# Altium schematic sheet MainSch.SchDoc: TestBoard (part 2 of 3)
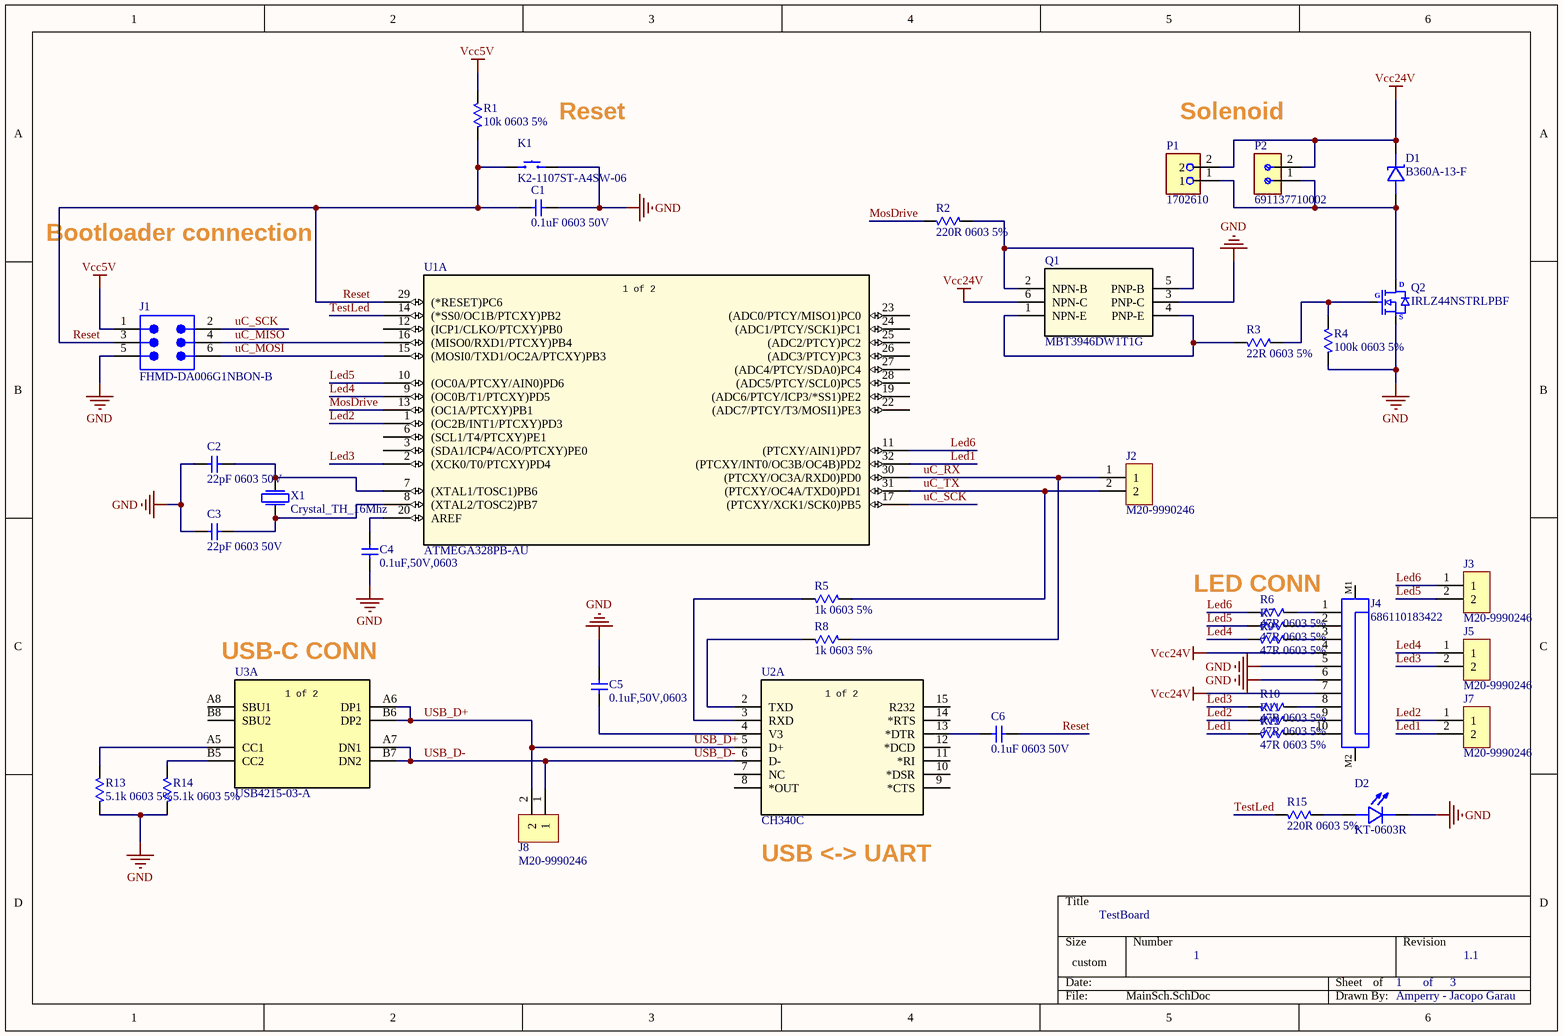
[diagram p1: MainSch.SchDoc]
## Library data of the parts
C1 C6 = CMP-001-00088-6: 50V 0.1uF (100nF) X7R ±10% 0603 Multilayer Ceramic Capacitors MLCC - SMD/SMT ROHS; Manufacturer Part Number: CL10B104KB8NNNC; Manufacturer: Samsung Electro-Mechanics; ComponentLink8Description: https://datasheet.octopart.com/General-Multilayer-Ceramic-Capacitors-Samsung-datasheet-family-111.pdf; Thickness: 889µm; ComponentLink15Description: http://sigma.octopart.com:80/rohs_certificate/General-Multilayer-Ceramic-Capacitors-Samsung-family-110.pdf?src-supplier=Compliance+Statements; Lifecycle Status: Production; ComponentLink16Description: http://sigma.octopart.com:80/rohs_statement/General-Multilayer-Ceramic-Capacitors-Samsung-family-132.pdf?src-supplier=Compliance+Statements; ComponentLink9URL: https://datasheet.octopart.com:443/CL10B104KB8NNNC-Samsung-Electro-Mechanics-datasheet-136482302.pdf?src-supplier=Samsung+SCT; ComponentLink17URL: http://sigma.octopart.com:80/reach_statement/General-Multilayer-Ceramic-Capacitors-Samsung-family-133.pdf?src-supplier=Compliance+Statements; Schedule B: 8532240020, 8532240020; JLCPCB Part Number: C1591; Material: Ceramic; REACH SVHC: Yes; Width: 800µm; ComponentLink16URL: http://sigma.octopart.com:80/rohs_statement/General-Multilayer-Ceramic-Capacitors-Samsung-family-132.pdf?src-supplier=Compliance+Statements; Source: MySchLib.SchLib; ComponentLink12URL: https://datasheet.octopart.com:443/CL10B104KB8NNNC-Samsung-Electro-Mechanics-datasheet-149136784.pdf?src-supplier=Future+Electronics; ComponentLink7Description: https://datasheet.octopart.com/CL10B104KB8NNNC-Samsung-Electro-Mechanics-datasheet-97040617.pdf; ComponentLink14Description: https://datasheet.octopart.com:443/CL10B104KB8NNNC-Samsung-Electro-Mechanics-datasheet-11837008.pdf?src-supplier=Arrow+Electronics; Design Item ID: CL10B104KB8NNNC; ComponentLink1URL: https://datasheet.octopart.com:443/CL10B104KB8NNNC-Samsung-datasheet-165517828.pdf?src-supplier=Upverter; ComponentLink1Description: https://datasheet.octopart.com:443/CL10B104KB8NNNC-Samsung-datasheet-165517828.pdf?src-supplier=Upverter; Tolerance: 10%; Min Operating Temperature: -55°C; Max Operating Temperature: 125°C; ComponentLink3URL: https://datasheet.octopart.com:443/CL10B104KB8NNNC-Samsung-Electro-Mechanics-datasheet-81461840.pdf?src-supplier=Upverter; ComponentLink2URL: https://datasheet.octopart.com:443/CL10B104KB8NNNC-Samsung-Electro-Mechanics-datasheet-116890969.pdf?src-supplier=Upverter; Pin Count: 2; Voltage: 50V; Voltage Rating: 50V; Category: Ceramic Capacitors; ComponentLink9Description: https://datasheet.octopart.com:443/CL10B104KB8NNNC-Samsung-Electro-Mechanics-datasheet-136482302.pdf?src-supplier=Samsung+SCT; Dielectric Material: Ceramic; ComponentLink11URL: https://datasheet.octopart.com:443/CL10B104KB8NNNC-Samsung-datasheet-26589154.pdf?src-supplier=Future+Electronics; ComponentLink2Description: https://datasheet.octopart.com:443/CL10B104KB8NNNC-Samsung-Electro-Mechanics-datasheet-116890969.pdf?src-supplier=Upverter; Stock: 8176073; ComponentLink4URL: https://datasheet.octopart.com:443/CL10B104KB8NNNC-Samsung-Electro-Mechanics-datasheet-181551448.pdf?src-supplier=Newark; RoHS: Compliant; China RoHS: Compliant; ComponentLink17Description: http://sigma.octopart.com:80/reach_statement/General-Multilayer-Ceramic-Capacitors-Samsung-family-133.pdf?src-supplier=Compliance+Statements; Radiation Hardening: No; ComponentLink6URL: https://datasheet.octopart.com/CL10B104KB8NNNC-Samsung-Electro-Mechanics-datasheet-8324245.pdf; Voltage Rating (DC): 50V; Contact Plating: Tin; ComponentLink11Description: https://datasheet.octopart.com:443/CL10B104KB8NNNC-Samsung-datasheet-26589154.pdf?src-supplier=Future+Electronics; ComponentLink5URL: https://datasheet.octopart.com:443/CL10B104KB8NNNC-Samsung-Electro-Mechanics-datasheet-181551449.pdf?src-supplier=Newark; Lead Free: Lead Free; Dielectric: X7R; ComponentLink8URL: https://datasheet.octopart.com/General-Multilayer-Ceramic-Capacitors-Samsung-datasheet-family-111.pdf; Height: 900µm; ComponentLink12Description: https://datasheet.octopart.com:443/CL10B104KB8NNNC-Samsung-Electro-Mechanics-datasheet-149136784.pdf?src-supplier=Future+Electronics; Case Code (Imperial): 0603; Pricing: 1=0.1, 10=0.027, 50=0.018, 100=0.0153, 500=0.0108, 1000=0.00941 (USD); ComponentLink5Description: https://datasheet.octopart.com:443/CL10B104KB8NNNC-Samsung-Electro-Mechanics-datasheet-181551449.pdf?src-supplier=Newark; ComponentLink7URL: https://datasheet.octopart.com/CL10B104KB8NNNC-Samsung-Electro-Mechanics-datasheet-97040617.pdf; ComponentLink14URL: https://datasheet.octopart.com:443/CL10B104KB8NNNC-Samsung-Electro-Mechanics-datasheet-11837008.pdf?src-supplier=Arrow+Electronics; Value: 100nF; ComponentLink13URL: https://datasheet.octopart.com:443/CL10B104KB8NNNC-Samsung-datasheet-22147433.pdf?src-supplier=TME; Length: 1.6mm; ComponentLink10Description: https://datasheet.octopart.com:443/CL10B104KB8NNNC-Samsung-datasheet-42770373.pdf?src-supplier=Future+Electronics; Case/Package: 0603; ComponentLink4Description: https://datasheet.octopart.com:443/CL10B104KB8NNNC-Samsung-Electro-Mechanics-datasheet-181551448.pdf?src-supplier=Newark; ComponentLink6Description: https://datasheet.octopart.com/CL10B104KB8NNNC-Samsung-Electro-Mechanics-datasheet-8324245.pdf; Component Type: Standard; Number of Terminals: 2; Depth: 800µm; Case Code (Metric): 1608; Mounting Technology: Surface Mount; ComponentLink15URL: http://sigma.octopart.com:80/rohs_certificate/General-Multilayer-Ceramic-Capacitors-Samsung-family-110.pdf?src-supplier=Compliance+Statements; ComponentLink3Description: https://datasheet.octopart.com:443/CL10B104KB8NNNC-Samsung-Electro-Mechanics-datasheet-81461840.pdf?src-supplier=Upverter; ComponentLink10URL: https://datasheet.octopart.com:443/CL10B104KB8NNNC-Samsung-datasheet-42770373.pdf?src-supplier=Future+Electronics; ComponentLink13Description: https://datasheet.octopart.com:443/CL10B104KB8NNNC-Samsung-datasheet-22147433.pdf?src-supplier=TME
C2 C3 = CMP-001-00085-6: 25V 10uF C0G ±5% 0603 Multilayer Ceramic Capacitors MLCC - SMD/SMT ROHS; Manufacturer Part Number: C0603C220J5GACTU; Manufacturer: Yageo Group; Temperature Coefficient: 30ppm/°C; Max Operating Temperature: 125°C; Height: 800µm; ComponentLink2URL: https://datasheet.octopart.com:443/C0603C220J5GAC7867-KEMET-datasheet-184792853.pdf?src-supplier=IHS; Termination: SMD/SMT; Voltage: 50V; ComponentLink19URL: https://datasheet.octopart.com:443/C0603C220J5GAC7867-KEMET-datasheet-164857143.pdf?src-supplier=Burklin+Elektronik; REACH SVHC: Yes; Depth: 800µm; Voltage Rating (DC): 50V; Export Control Classification Number (ECCN) Code: EAR99; ComponentLink21Description: https://datasheet.octopart.com:443/C0603C220J5GACTU-Kemet-datasheet-464.pdf?src-supplier=RS+(Formerly+Allied+Electronics); ComponentLink5Description: https://datasheet.octopart.com:443/C0603C220J5GACTU-Kemet-datasheet-5314449.pdf?src-supplier=Newark; ComponentLink8Description: https://datasheet.octopart.com:443/C0603C220J5GACTU-KEMET-datasheet-149521956.pdf?src-supplier=Farnell; Source: MySchLib.SchLib; Mounting Technology: Surface Mount; ComponentLink11URL: https://datasheet.octopart.com:443/C0603C220J5GACTU-KEMET-datasheet-176142187.pdf?src-supplier=element14+APAC; ComponentLink16URL: https://datasheet.octopart.com:443/C0603C220J5GACTU-KEMET-datasheet-41232428.pdf?src-supplier=Electro+Sonic; ComponentLink9URL: https://datasheet.octopart.com:443/C0603C220J5GACTU-KEMET-datasheet-101575729.pdf?src-supplier=Farnell; RoHS: Compliant; Category: Ceramic Capacitors; ComponentLink17Description: https://datasheet.octopart.com:443/C0603C220J5GACTU-KEMET-datasheet-96931677.pdf?src-supplier=TME; Harmonized Tariff Schedule (HTS) Code: 8532.24.00.20; JLCPCB Part Number: C2167297; Contact Material: Tin; ComponentLink14URL: https://datasheet.octopart.com:443/C0603C220J5GACTU-Kemet-datasheet-48952580.pdf?src-supplier=element14+APAC; ComponentLink17URL: https://datasheet.octopart.com:443/C0603C220J5GACTU-KEMET-datasheet-96931677.pdf?src-supplier=TME; ComponentLink18Description: https://datasheet.octopart.com/C0603C220J5GACTU-KEMET-datasheet-84169754.pdf; China RoHS: Compliant; ComponentLink15Description: https://datasheet.octopart.com:443/C0603C220J5GACTU-KEMET-datasheet-157246123.pdf?src-supplier=Electro+Sonic; Introduction Date: 2008-06-06; ComponentLink1Description: https://datasheet.octopart.com:443/C0603C220J5GACTU-KEMET-datasheet-178132257.pdf?src-supplier=IHS; ComponentLink12URL: https://datasheet.octopart.com:443/C0603C220J5GACTU-KEMET-datasheet-176142144.pdf?src-supplier=element14+APAC; Number of Terminals: 2; ComponentLink5URL: https://datasheet.octopart.com:443/C0603C220J5GACTU-Kemet-datasheet-5314449.pdf?src-supplier=Newark; Pricing: 1=0.13, 10=0.072, 50=0.05, 100=0.0434, 500=0.0322, 1000=0.02877 (USD); ComponentLink20URL: https://datasheet.octopart.com:443/C0603C220J5GAC-TU-Kemet-datasheet-7278821.pdf?src-supplier=Jameco; ComponentLink18URL: https://datasheet.octopart.com/C0603C220J5GACTU-KEMET-datasheet-84169754.pdf; Case/Package: 0603; ComponentLink14Description: https://datasheet.octopart.com:443/C0603C220J5GACTU-Kemet-datasheet-48952580.pdf?src-supplier=element14+APAC; ComponentLink4Description: https://datasheet.octopart.com:443/C0603C220J5GACTU-KEMET-datasheet-137357764.pdf?src-supplier=Upverter; Design Item ID: C0603C220J5GACTU; Dielectric: C0G; ComponentLink7URL: https://datasheet.octopart.com:443/C0603C220J5GACTU-KEMET-datasheet-176142189.pdf?src-supplier=Newark; Width: 800µm; ComponentLink22URL: http://sigma.octopart.com:80/conflict_mineral_statement/Yageo-company-3.pdf?src-supplier=Compliance+Statements; ComponentLink20Description: https://datasheet.octopart.com:443/C0603C220J5GAC-TU-Kemet-datasheet-7278821.pdf?src-supplier=Jameco; Schedule B: 8532240020, 8532240020; Country of Origin: Mainland China, Mexico; Dielectric Material: Ceramic; Length: 1.6mm; Stock: 283369; ComponentLink3URL: https://datasheet.octopart.com:443/C0603C220J5GACTU-KEMET-datasheet-68331921.pdf?src-supplier=Upverter; Weight: 2.012816mg; ComponentLink7Description: https://datasheet.octopart.com:443/C0603C220J5GACTU-KEMET-datasheet-176142189.pdf?src-supplier=Newark; Min Operating Temperature: -55°C; ComponentLink23URL: http://sigma.octopart.com:80/rohs_statement/Yageo-company-2.pdf?src-supplier=Compliance+Statements; Pins: 2; ComponentLink16Description: https://datasheet.octopart.com:443/C0603C220J5GACTU-KEMET-datasheet-41232428.pdf?src-supplier=Electro+Sonic; ComponentLink11Description: https://datasheet.octopart.com:443/C0603C220J5GACTU-KEMET-datasheet-176142187.pdf?src-supplier=element14+APAC; ComponentLink13Description: https://datasheet.octopart.com:443/C0603C220J5GACTU-Kemet-datasheet-22084244.pdf?src-supplier=element14+APAC; Radiation Hardening: No; ComponentLink10Description: https://datasheet.octopart.com:443/C0603C220J5GACTU-Kemet-datasheet-10540709.pdf?src-supplier=Farnell; ComponentLink15URL: https://datasheet.octopart.com:443/C0603C220J5GACTU-KEMET-datasheet-157246123.pdf?src-supplier=Electro+Sonic; ComponentLink8URL: https://datasheet.octopart.com:443/C0603C220J5GACTU-KEMET-datasheet-149521956.pdf?src-supplier=Farnell; ComponentLink21URL: https://datasheet.octopart.com:443/C0603C220J5GACTU-Kemet-datasheet-464.pdf?src-supplier=RS+(Formerly+Allied+Electronics); ComponentLink3Description: https://datasheet.octopart.com:443/C0603C220J5GACTU-KEMET-datasheet-68331921.pdf?src-supplier=Upverter; Tolerance: 5%; ComponentLink10URL: https://datasheet.octopart.com:443/C0603C220J5GACTU-Kemet-datasheet-10540709.pdf?src-supplier=Farnell; ComponentLink2Description: https://datasheet.octopart.com:443/C0603C220J5GAC7867-KEMET-datasheet-184792853.pdf?src-supplier=IHS; ComponentLink23Description: http://sigma.octopart.com:80/rohs_statement/Yageo-company-2.pdf?src-supplier=Compliance+Statements; ComponentLink13URL: https://datasheet.octopart.com:443/C0603C220J5GACTU-Kemet-datasheet-22084244.pdf?src-supplier=element14+APAC; ComponentLink6URL: https://datasheet.octopart.com:443/C0603C220J5GACTU-Kemet-datasheet-10282724.pdf?src-supplier=Newark; Pin Count: 2; ComponentLink19Description: https://datasheet.octopart.com:443/C0603C220J5GAC7867-KEMET-datasheet-164857143.pdf?src-supplier=Burklin+Elektronik; Case Code (Imperial): 0603; ComponentLink9Description: https://datasheet.octopart.com:443/C0603C220J5GACTU-KEMET-datasheet-101575729.pdf?src-supplier=Farnell; Voltage Rating: 50V; ComponentLink4URL: https://datasheet.octopart.com:443/C0603C220J5GACTU-KEMET-datasheet-137357764.pdf?src-supplier=Upverter; Lead Free: Lead Free; Value: 22pF; Material: Ceramic; ComponentLink6Description: https://datasheet.octopart.com:443/C0603C220J5GACTU-Kemet-datasheet-10282724.pdf?src-supplier=Newark; Lifecycle Status: Production; ComponentLink22Description: http://sigma.octopart.com:80/conflict_mineral_statement/Yageo-company-3.pdf?src-supplier=Compliance+Statements; Component Type: Standard; Thickness: 863.6µm; ComponentLink1URL: https://datasheet.octopart.com:443/C0603C220J5GACTU-KEMET-datasheet-178132257.pdf?src-supplier=IHS; Packaging: Cut Tape; ComponentLink12Description: https://datasheet.octopart.com:443/C0603C220J5GACTU-KEMET-datasheet-176142144.pdf?src-supplier=element14+APAC
C4 C5 = CL10B104KB8NNNC: 50V 0.1uF X7R 10% Pad SMD 0603 125°C T/R Ceramic Capacitor (MLCC; Manufacturer: Samsung Electro-Mechanics; Value: 100nF; Supplier: DigiKey; Supplier Part Number: 1276-1000-1-ND; Manufacturer Part Number: CL10B104KB8NNNC; RoHS: Compliant; Category: Ceramic Capacitors; Stock: 8176073; Pricing: 1=0.1, 10=0.027, 50=0.018, 100=0.0153, 500=0.0108, 1000=0.00941 (USD); Case/Package: 0603; Case Code (Imperial): 0603; Case Code (Metric): 1608; China RoHS: Compliant; Contact Plating: Tin; Depth: 800µm; Dielectric: X7R; Dielectric Material: Ceramic; Height: 900µm; Lead Free: Lead Free; Length: 1.6mm; Lifecycle Status: Production; Material: Ceramic; Max Operating Temperature: 125°C; Min Operating Temperature: -55°C; Mounting Technology: Surface Mount; Number of Terminals: 2; Radiation Hardening: No; REACH SVHC: Yes; Schedule B: 8532240020, 8532240020|8532240020|8532240020|8532240020|8532240020|8532240020|8532240020|8532240020|8532240020|8532240020, 8532240020|8532240020|8532240020|8532240020|8532240020|8532240020|8532240020|8532240020|8532240020|8532240020|8532240020, 8532240020|8532240020|8532240020|8532240020|8532240020|8532240020|8532240020|8532240020|8532240020|8532240020|8532240020|8532240020; Thickness: 889µm; Tolerance: 10%; Voltage: 50V; Voltage Rating: 50V; Voltage Rating (DC): 50V; Width: 800µm; ComponentLink1URL: https://datasheet.octopart.com:443/CL10B104KB8NNNC-Samsung-datasheet-165517828.pdf?src-supplier=Upverter; ComponentLink1Description: https://datasheet.octopart.com:443/CL10B104KB8NNNC-Samsung-datasheet-165517828.pdf?src-supplier=Upverter; ComponentLink2URL: https://datasheet.octopart.com:443/CL10B104KB8NNNC-Samsung-Electro-Mechanics-datasheet-116890969.pdf?src-supplier=Upverter; ComponentLink2Description: https://datasheet.octopart.com:443/CL10B104KB8NNNC-Samsung-Electro-Mechanics-datasheet-116890969.pdf?src-supplier=Upverter; ComponentLink3URL: https://datasheet.octopart.com:443/CL10B104KB8NNNC-Samsung-Electro-Mechanics-datasheet-81461840.pdf?src-supplier=Upverter; ComponentLink3Description: https://datasheet.octopart.com:443/CL10B104KB8NNNC-Samsung-Electro-Mechanics-datasheet-81461840.pdf?src-supplier=Upverter; ComponentLink4URL: https://datasheet.octopart.com:443/CL10B104KB8NNNC-Samsung-Electro-Mechanics-datasheet-181551448.pdf?src-supplier=Newark; ComponentLink4Description: https://datasheet.octopart.com:443/CL10B104KB8NNNC-Samsung-Electro-Mechanics-datasheet-181551448.pdf?src-supplier=Newark; ComponentLink5URL: https://datasheet.octopart.com:443/CL10B104KB8NNNC-Samsung-Electro-Mechanics-datasheet-181551449.pdf?src-supplier=Newark; ComponentLink5Description: https://datasheet.octopart.com:443/CL10B104KB8NNNC-Samsung-Electro-Mechanics-datasheet-181551449.pdf?src-supplier=Newark; ComponentLink6URL: https://datasheet.octopart.com/CL10B104KB8NNNC-Samsung-Electro-Mechanics-datasheet-8324245.pdf; ComponentLink6Description: https://datasheet.octopart.com/CL10B104KB8NNNC-Samsung-Electro-Mechanics-datasheet-8324245.pdf; ComponentLink7URL: https://datasheet.octopart.com/CL10B104KB8NNNC-Samsung-Electro-Mechanics-datasheet-97040617.pdf; ComponentLink7Description: https://datasheet.octopart.com/CL10B104KB8NNNC-Samsung-Electro-Mechanics-datasheet-97040617.pdf; ComponentLink8URL: https://datasheet.octopart.com/General-Multilayer-Ceramic-Capacitors-Samsung-datasheet-family-111.pdf; ComponentLink8Description: https://datasheet.octopart.com/General-Multilayer-Ceramic-Capacitors-Samsung-datasheet-family-111.pdf; ComponentLink9URL: https://datasheet.octopart.com:443/CL10B104KB8NNNC-Samsung-Electro-Mechanics-datasheet-136482302.pdf?src-supplier=Samsung+SCT; ComponentLink9Description: https://datasheet.octopart.com:443/CL10B104KB8NNNC-Samsung-Electro-Mechanics-datasheet-136482302.pdf?src-supplier=Samsung+SCT; ComponentLink10URL: https://datasheet.octopart.com:443/CL10B104KB8NNNC-Samsung-datasheet-42770373.pdf?src-supplier=Future+Electronics; ComponentLink10Description: https://datasheet.octopart.com:443/CL10B104KB8NNNC-Samsung-datasheet-42770373.pdf?src-supplier=Future+Electronics; ComponentLink11URL: https://datasheet.octopart.com:443/CL10B104KB8NNNC-Samsung-datasheet-26589154.pdf?src-supplier=Future+Electronics; ComponentLink11Description: https://datasheet.octopart.com:443/CL10B104KB8NNNC-Samsung-datasheet-26589154.pdf?src-supplier=Future+Electronics; ComponentLink12URL: https://datasheet.octopart.com:443/CL10B104KB8NNNC-Samsung-Electro-Mechanics-datasheet-149136784.pdf?src-supplier=Future+Electronics; ComponentLink12Description: https://datasheet.octopart.com:443/CL10B104KB8NNNC-Samsung-Electro-Mechanics-datasheet-149136784.pdf?src-supplier=Future+Electronics; ComponentLink13URL: https://datasheet.octopart.com:443/CL10B104KB8NNNC-Samsung-datasheet-22147433.pdf?src-supplier=TME; ComponentLink13Description: https://datasheet.octopart.com:443/CL10B104KB8NNNC-Samsung-datasheet-22147433.pdf?src-supplier=TME; ComponentLink14URL: https://datasheet.octopart.com:443/CL10B104KB8NNNC-Samsung-Electro-Mechanics-datasheet-11837008.pdf?src-supplier=Arrow+Electronics; ComponentLink14Description: https://datasheet.octopart.com:443/CL10B104KB8NNNC-Samsung-Electro-Mechanics-datasheet-11837008.pdf?src-supplier=Arrow+Electronics; ComponentLink15URL: http://sigma.octopart.com:80/rohs_certificate/General-Multilayer-Ceramic-Capacitors-Samsung-family-110.pdf?src-supplier=Compliance+Statements; ComponentLink15Description: http://sigma.octopart.com:80/rohs_certificate/General-Multilayer-Ceramic-Capacitors-Samsung-family-110.pdf?src-supplier=Compliance+Statements; ComponentLink16URL: http://sigma.octopart.com:80/rohs_statement/General-Multilayer-Ceramic-Capacitors-Samsung-family-132.pdf?src-supplier=Compliance+Statements; ComponentLink16Description: http://sigma.octopart.com:80/rohs_statement/General-Multilayer-Ceramic-Capacitors-Samsung-family-132.pdf?src-supplier=Compliance+Statements; ComponentLink17URL: http://sigma.octopart.com:80/reach_statement/General-Multilayer-Ceramic-Capacitors-Samsung-family-133.pdf?src-supplier=Compliance+Statements; ComponentLink17Description: http://sigma.octopart.com:80/reach_statement/General-Multilayer-Ceramic-Capacitors-Samsung-family-133.pdf?src-supplier=Compliance+Statements; JLCBPC Part Number: C1591
D1 = CMP-004-00034-4: 60V 3.0A SURFACE MOUNT SCHOTTKY BARRIER RECTIFIER; Source: Altium_Library.SchLib; Pin Count: 2; Design Item ID: B360A-13-F; Component Type: Standard
D2 = CMP-004-00032-5: Diode Red 20mA; Manufacturer Part Number: ERJ3GEYJ470V; Manufacturer Lifecycle Status: ACTIVE; Manufacturer: Panasonic; Part Series: Thick Film Chip Resistors; Power Rating: 100mW; Voltage Rating (DC): 75V; Temperature Coefficient: 200ppm/°C; Tolerance: 5%; Value: 47O; Composition: Thick Film; ComponentLink15URL: https://datasheet.octopart.com:443/ERJ-3GEYJ470V-Panasonic-datasheet-118598.pdf?src-supplier=DigiKey; ComponentLink4URL: https://datasheet.octopart.com:443/ERJ-3GEYJ470V-Panasonic-datasheet-5314550.pdf?src-supplier=Farnell; ComponentLink5Description: https://datasheet.octopart.com:443/ERJ3GEYJ470V-Panasonic-datasheet-10554283.pdf?src-supplier=Farnell; ComponentLink7URL: https://datasheet.octopart.com:443/ERJ-3GEYJ470V-Panasonic-datasheet-147443676.pdf?src-supplier=Master+Electronics; Design Item ID: KT-0603R; ComponentLink7Description: https://datasheet.octopart.com:443/ERJ-3GEYJ470V-Panasonic-datasheet-147443676.pdf?src-supplier=Master+Electronics; Pin Count: 2; Width: 800µm; ComponentLink11Description: https://datasheet.octopart.com:443/ERJ3GEYJ470V-Panasonic-datasheet-13266541.pdf?src-supplier=Future+Electronics; Export Control Classification Number (ECCN) Code: EAR99; ComponentLink6URL: https://datasheet.octopart.com:443/ERJ-3GEYJ470V-Panasonic---ECG-datasheet-15994758.pdf?src-supplier=Farnell; RoHS: Compliant; Parameter 1: *; ComponentLink12URL: https://datasheet.octopart.com:443/ERJ3GEYJ470V-Panasonic-datasheet-138819430.pdf?src-supplier=TME; ComponentLink5URL: https://datasheet.octopart.com:443/ERJ3GEYJ470V-Panasonic-datasheet-10554283.pdf?src-supplier=Farnell; Number of Terminals: 2; ComponentLink3URL: https://datasheet.octopart.com:443/ERJ3GEYJ470V-Panasonic-datasheet-13266872.pdf?src-supplier=RS+(Formerly+Allied+Electronics); Working Voltage: 75V; Introduction Date: 1998-09-24; ComponentLink15Description: https://datasheet.octopart.com:443/ERJ-3GEYJ470V-Panasonic-datasheet-118598.pdf?src-supplier=DigiKey; Component Type: Standard; ComponentLink16Description: https://datasheet.octopart.com:443/ERJ3GEYJ470V-Panasonic-datasheet-27908757.pdf?src-supplier=Electro+Sonic; Case Code (Imperial): 0603; Features: Automotive AEC-Q200; JLCPCB Part Number: C2286; ComponentLink1URL: https://datasheet.octopart.com:443/ERJ3GEYJ470V-Panasonic-datasheet-61114972.pdf?src-supplier=Newark; ComponentLink4Description: https://datasheet.octopart.com:443/ERJ-3GEYJ470V-Panasonic-datasheet-5314550.pdf?src-supplier=Farnell; ComponentLink3Description: https://datasheet.octopart.com:443/ERJ3GEYJ470V-Panasonic-datasheet-13266872.pdf?src-supplier=RS+(Formerly+Allied+Electronics); Max Power Dissipation: 100mW; Stock: 15000; ComponentLink8URL: https://datasheet.octopart.com:443/ERJ3GEYJ470V-Panasonic-datasheet-5313456.pdf?src-supplier=Future+Electronics; ComponentLink10URL: https://datasheet.octopart.com:443/ERJ3GEYJ470V-Panasonic-datasheet-8853621.pdf?src-supplier=Future+Electronics; Military Standard: Not; ComponentLink8Description: https://datasheet.octopart.com:443/ERJ3GEYJ470V-Panasonic-datasheet-5313456.pdf?src-supplier=Future+Electronics; ComponentLink12Description: https://datasheet.octopart.com:443/ERJ3GEYJ470V-Panasonic-datasheet-138819430.pdf?src-supplier=TME; Height: 450µm; Contact Plating: Tin; Length: 1.6mm; Max Operating Temperature: 155°C; Schedule B: 8533210045, 8533210045; Number of Terminations: 2; ComponentLink9Description: https://datasheet.octopart.com:443/ERJ3GEYJ470V-Panasonic-datasheet-10025800.pdf?src-supplier=Future+Electronics; Ratings: AEC-Q200; Radiation Hardening: No; REACH SVHC: Yes; Case/Package: 0603; ComponentLink13URL: https://datasheet.octopart.com/ERJ3GEYJ470V-Panasonic-datasheet-78375410.pdf; Voltage Rating: 75V; Packaging: Cut Tape; ComponentLink16URL: https://datasheet.octopart.com:443/ERJ3GEYJ470V-Panasonic-datasheet-27908757.pdf?src-supplier=Electro+Sonic; ComponentLink13Description: https://datasheet.octopart.com/ERJ3GEYJ470V-Panasonic-datasheet-78375410.pdf; Pricing: 50000=0.006 (USD); Lead Free: Lead Free; ComponentLink11URL: https://datasheet.octopart.com:443/ERJ3GEYJ470V-Panasonic-datasheet-13266541.pdf?src-supplier=Future+Electronics; Mounting Technology: Surface Mount; ComponentLink17URL: https://datasheet.octopart.com:443/ERJ3GEYJ470V-Panasonic-datasheet-37173568.pdf?src-supplier=Electro+Sonic; Depth: 800µm; Category: Chip SMD Resistors; ComponentLink10Description: https://datasheet.octopart.com:443/ERJ3GEYJ470V-Panasonic-datasheet-8853621.pdf?src-supplier=Future+Electronics; Harmonized Tariff Schedule (HTS) Code: 8533.21.00.30; Min Operating Temperature: -55°C; ComponentLink2URL: https://datasheet.octopart.com:443/ERJ3GEYJ470V-Panasonic-datasheet-136608608.pdf?src-supplier=Newark; ComponentLink9URL: https://datasheet.octopart.com:443/ERJ3GEYJ470V-Panasonic-datasheet-10025800.pdf?src-supplier=Future+Electronics; ComponentLink14URL: https://datasheet.octopart.com:443/ERJ3GEYJ470V-Panasonic-datasheet-7538305.pdf?src-supplier=Jameco; ComponentLink17Description: https://datasheet.octopart.com:443/ERJ3GEYJ470V-Panasonic-datasheet-37173568.pdf?src-supplier=Electro+Sonic; ComponentLink6Description: https://datasheet.octopart.com:443/ERJ-3GEYJ470V-Panasonic---ECG-datasheet-15994758.pdf?src-supplier=Farnell; ComponentLink14Description: https://datasheet.octopart.com:443/ERJ3GEYJ470V-Panasonic-datasheet-7538305.pdf?src-supplier=Jameco; ComponentLink2Description: https://datasheet.octopart.com:443/ERJ3GEYJ470V-Panasonic-datasheet-136608608.pdf?src-supplier=Newark; Country of Origin: Japan, Mainland China; Termination: SMD/SMT; Source: MySchLib.SchLib; ComponentLink1Description: https://datasheet.octopart.com:443/ERJ3GEYJ470V-Panasonic-datasheet-61114972.pdf?src-supplier=Newark; Lifecycle Status: Production
J1 = CMP-002-00076-3: Header_Female_2x3_2.54mm; Manufacturer: Sullins; Manufacturer Part Number: PPTC032LFBN-RC; Dielectric Material: Polyester; Number of Positions: 6; Row Spacing: 2.54mm; Connector Type: Header, Socket; Current Rating: 3A; Gender: Female; Lifecycle Status: Production; Length: 8.12mm; Height: 8.5mm; ComponentLink2Description: https://datasheet.octopart.com:443/PPTC032LFBN-RC-Sullins-datasheet-41308905.pdf?src-supplier=Future+Electronics; ComponentLink4Description: https://datasheet.octopart.com:443/PPTC032LFBN-RC-Sullins-datasheet-12511165.pdf?src-supplier=Future+Electronics; Housing Material: Plastic; ComponentLink1Description: https://datasheet.octopart.com:443/PPTC032LFBN-RC-Sullins-datasheet-138810743.pdf?src-supplier=IHS; Mounting Technology: Through Hole; ComponentLink3Description: https://datasheet.octopart.com:443/PPTC032LFBN-RC-Sullins-datasheet-32035511.pdf?src-supplier=Future+Electronics; Stock: 18339; Number of Rows: 2; Contact Plating: Tin; Pricing: 1=0.53, 10=0.453, 100=0.3851, 500=0.3437, 1000=0.32728, 5000=0.29213, 10000=0.2782 (USD); Component Type: Standard; Harmonized Tariff Schedule (HTS) Code: 8536.69.40.40; Design Item ID: Header_Female_2*3; Color: Black; Width: 5mm; Termination: Solder; Pin Count: 6; Lead Free: Lead Free; Packaging: Bulk; Introduction Date: 2008-05-14; REACH SVHC: Yes; ComponentLink1URL: https://datasheet.octopart.com:443/PPTC032LFBN-RC-Sullins-datasheet-138810743.pdf?src-supplier=IHS; Pitch: 2.54mm; RoHS: Compliant; Contact Material: Bronze; Source: MySchLib.SchLib; Category: Card Edge Connectors; Export Control Classification Number (ECCN) Code: EAR99; Terminal Pitch: 2.54mm; ComponentLink2URL: https://datasheet.octopart.com:443/PPTC032LFBN-RC-Sullins-datasheet-41308905.pdf?src-supplier=Future+Electronics; ComponentLink3URL: https://datasheet.octopart.com:443/PPTC032LFBN-RC-Sullins-datasheet-32035511.pdf?src-supplier=Future+Electronics; JLCPCB Part Number: C5116527; ComponentLink4URL: https://datasheet.octopart.com:443/PPTC032LFBN-RC-Sullins-datasheet-12511165.pdf?src-supplier=Future+Electronics
J2 J3 J5 J7 J8 = CMP-002-00077-2: Header Male 1x2 2.54mm; Manufacturer: Harwin; Number of Positions: 2; Voltage Rating (AC): 750V; Connector Type: Male Pin; Max Current Rating: 3A; Contact Resistance: 30mO; Dielectric Material: Polyamide; Insulation Resistance: 1GO; JLCPCB Part Number: C90288; Max Operating Temperature: 105°C; Height: 8.99mm; REACH SVHC: Yes; Radiation Hardening: No; Color: Black; Housing Color: Black; ComponentLink3Description: https://datasheet.octopart.com:443/M20-9990246-Harwin-datasheet-96624206.pdf?src-supplier=element14+APAC; Terminal Pitch: 2.54mm; Export Control Classification Number (ECCN) Code: EAR99; Case/Package: SIL; Introduction Date: 2005-06-27; ComponentLink4Description: https://datasheet.octopart.com:443/M20-9990246-Harwin-datasheet-32864541.pdf?src-supplier=Farnell; ComponentLink5Description: https://datasheet.octopart.com:443/M20-9990246-Harwin-datasheet-7538443.pdf?src-supplier=Farnell; Mounting Technology: Through Hole; ComponentLink5URL: https://datasheet.octopart.com:443/M20-9990246-Harwin-datasheet-7538443.pdf?src-supplier=Farnell; Category: Headers and Wire Housings; Country of Origin: Taiwan; Pitch: 2.54mm; Length: 5.08mm; Pin Count: 2; Lifecycle Status: Production; Contact Mating Length: 6.096mm; Contact Plating: Tin; Termination: Solder; Number of Contacts: 2; Source: MySchLib.SchLib; ComponentLink6Description: https://datasheet.octopart.com:443/M20-9990246-Harwin-datasheet-508868.pdf?src-supplier=Farnell; Housing Material: Nylon; ComponentLink2URL: https://datasheet.octopart.com:443/M20-9990246-Harwin-datasheet-27378916.pdf?src-supplier=Newark; Number of Rows: 1; Current Rating: 3A; Depth: 2.54mm; Lead Pitch: 2.54mm; ComponentLink1URL: https://datasheet.octopart.com:443/M20-9990246-Harwin-datasheet-169407857.pdf?src-supplier=Newark; Min Operating Temperature: -40°C; ComponentLink6URL: https://datasheet.octopart.com:443/M20-9990246-Harwin-datasheet-508868.pdf?src-supplier=Farnell; Pricing: 1=0.1, 10=0.079, 100=0.0669, 500=0.0597, 1000=0.05684, 5000=0.05073, 10000=0.04831 (USD); Gender: Male; Stock: 105807; Contact Material: Brass; Design Item ID: M20-9990246; ComponentLink2Description: https://datasheet.octopart.com:443/M20-9990246-Harwin-datasheet-27378916.pdf?src-supplier=Newark; Pins: 2; ComponentLink1Description: https://datasheet.octopart.com:443/M20-9990246-Harwin-datasheet-169407857.pdf?src-supplier=Newark; Orientation: Straight; Component Type: Standard; Packaging: Bulk; RoHS: Compliant; ComponentLink3URL: https://datasheet.octopart.com:443/M20-9990246-Harwin-datasheet-96624206.pdf?src-supplier=element14+APAC; ComponentLink4URL: https://datasheet.octopart.com:443/M20-9990246-Harwin-datasheet-32864541.pdf?src-supplier=Farnell; Harmonized Tariff Schedule (HTS) Code: 8536.69.40.40; Manufacturer Part Number: M20-9990246
J4 = CMP-036-000079-4: WR-FPC 1.00mm SMT Horiz. Top Cont. Low Profile; Manufacturer Lifecycle Status: ACTIVE; NexarPartId: 81848307; Pitch: 1mm; YEOL: 1 = Estimated lifetime > 10 years; Operating Supply Voltage: 50V; Current Rating: 800mA; Gender: Receptacle; Insulation Resistance: 100MΩ; Contact Resistance: 30mΩ; RoHS: Compliant; Pins: 10; Design Item ID: 686110183422; Min Operating Temperature: -25°C; Number of Pins: 10; Length: 11.1mm; Pin Count: 12; Lead Pitch: 1mm; Lifecycle Status: Production; Max Operating Temperature: 85°C; JLCPCB Part Number: C6095598; Component Type: Standard; Manufacturer Part Number: 686110183422; Orientation: Horizontal; Packaging: Tape and Reel; Source: MySchLib.SchLib
K1 = CMP-011-00013-5: Rectangular Button SMD(SMT) Tab SPST Surface Mount,Vertical Without Bracket SMD,6x3.6mm Tactile Switches ROHS; JLCPCB Part Number: C2837195; Source: MySchLib.SchLib; Design Item ID: K2-1107ST-A4SW-06; Pin Count: 2; Component Type: Standard
P1 = CMP-002-00072-6: Conn PC Terminal Block 2 POS 2.5mm Solder ST Thru-Hole 4A T/R; Voltage Rating: 160V; Number of Levels: 1; Current: 2A; Wire/Cable Gauge: 24AWG; Number of Contacts: 2; Voltage: 150V; Gender: Male; Width: 17.55mm; Housing Color: Black; Flammability Rating: UL94 V-0; Design Item ID: 1702610, prov; Height: 8mm; Material: Polymer; Current Rating: 4A; Source: MySchLib.SchLib; Pitch: 2.5mm; Orientation: Horizontal; Component Type: Standard; Contact Material: Tin; RoHS: Compliant; Color: Black; Number of Positions Per Level: 2; Number of Rows: 1; Depth: 17.5mm; REACH SVHC: Yes; Mounting Technology: PCB, Through Hole; Number of Positions: 2; Pin Count: 2; Lifecycle Status: Production; Pins: 2; Length: 17.55mm; Termination: IDC; Housing Material: Polymer; JLCPCB Part Number: C21433539
P2 = CMP-036-000080-3: Terminal Block, 5mm Pitch, Horizontal, Pressure Clamp Glow Wire, Pcb, 2PINS, Gr; Manufacturer: Wurth Elektronik; Voltage Rating: 300V; Number of Contacts: 2; Current Rating: 16A; Category: Terminal Blocks; RoHS: Compliant; Packaging: Box; Stock: 24231; Design Item ID: 691137710002; Length: 10mm; JLCPCB Part Number: C3703; Component Type: Standard; Contact Material: Nickel, Tin; Max Operating Temperature: 110°C; Source: MySchLib.SchLib; ComponentLink3Description: https://datasheet.octopart.com:443/691137710002-W%C3%BCrth-Elektronik-datasheet-138898892.pdf?src-supplier=Upverter; Height: 11.5mm; ComponentLink1Description: https://datasheet.octopart.com:443/691137710002-Wurth-Elektronik-datasheet-166323112.pdf?src-supplier=Wurth+Elektronik; ComponentLink2URL: https://datasheet.octopart.com:443/691137710002-W%C3%BCrth-Elektronik-datasheet-117282625.pdf?src-supplier=Wurth+Elektronik; Pitch: 5mm; Pins: 2; ComponentLink3URL: https://datasheet.octopart.com:443/691137710002-W%C3%BCrth-Elektronik-datasheet-138898892.pdf?src-supplier=Upverter; Min Operating Temperature: -30°C; ComponentLink1URL: https://datasheet.octopart.com:443/691137710002-Wurth-Elektronik-datasheet-166323112.pdf?src-supplier=Wurth+Elektronik; Manufacturer Part Number: 691137710002; Pricing: 1=0.41, 10=0.363, 50=0.32, 100=0.287, 500=0.277 (USD); Pin Count: 2; ComponentLink2Description: https://datasheet.octopart.com:443/691137710002-W%C3%BCrth-Elektronik-datasheet-117282625.pdf?src-supplier=Wurth+Elektronik; Lead Pitch: 5mm; Number of Rows: 1
Q1 = CMP-036-000088-2: Dual Npn+Pnp Rf Bipolar Transistor, 0.2 A, 40V, 6-PIN SC-88; Manufacturer Lifecycle Status: ACTIVE; Manufacturer: onsemi; Collector Emitter Saturation Voltage: 300mV; Power Dissipation: 150mW; Transition Frequency: 300MHz; Max Collector Current: 200mA; Collector Base Voltage (VCBO): 60V; Number of Elements: 2; Polarity: NPN, PNP; hFE Min: 30; Emitter Base Voltage (VEBO): 5V; Width: 1.35mm; ComponentLink1URL: https://datasheet.octopart.com:443/MBT3946DW1T1G-ON-Semiconductor-datasheet-8733982.pdf?src-supplier=Upverter; ComponentLink4Description: https://datasheet.octopart.com:443/MBT3946DW1T1G-onsemi-datasheet-181959054.pdf?src-supplier=Newark; Component Type: Standard; ComponentLink5Description: https://datasheet.octopart.com:443/MBT3946DW1T1G-ON-Semiconductor-datasheet-8123988.pdf?src-supplier=onsemi; Lead Free: Lead Free; Export Control Classification Number (ECCN) Code: EAR99; Pins: 6; Packaging: Tape and Reel; ComponentLink10Description: http://sigma.octopart.com:80/reach_statement/ON-Semiconductor-company-79.pdf?src-supplier=Compliance+Statements; Element Configuration: Dual; Clock Frequency: 300MHz; ComponentLink11URL: https://octopart.com:443/opatz8j6/c1?t=KExGiw7fVzcelvk-Le4wDxkM6D-rcpjtUrfE1ZnkBV1MEHfZW5pIblVuaNeX7tAqJdaaNxJ2hTDWsmCzxXF6UXlkyLkAFVEyfSFC-dz3mXUpSqcWplU2nWdRG5z1InXjEmusUj-8nsP9w_iTmWuEasAhDs2DNIUFXJnefYbYtIlTlG9nP5h3fZcncTha2JkO-YGgPnBD-R9hIY1a56svi-ABl7pPeB0blmwOOn-axnRyxdHzsQmPhFK4ZTpqwszMdgrm2nMkrexXFk7bhZX7TgLd2NPt5ZZ4373sCJaOlTerGriLJvqrLtinxa04dRTPq-WPk7pf8xNw7sWkA5V9tkrTEBovS5Xy8RO7fsaR_Q&src-supplier=Compliance+Statements; ComponentLink12Description: https://octopart.com:443/opatz8j6/c1?t=BISpIr3ce2Gk9m9EGmOSMwcK-x5suKSq_DrSb3eVUzWWJ4z4bkiXBslRgfr5v7yDwZzoUFysASo1ZzhqlQaJpngsy0772p-oxsjYAnshe9XcJmZ65XpfWSliA2xeOCy3IQ6K7q9WD0gmg1i8yBgSvh5cTfwtupqgCJl1fRBn7LV49bcAdFNpfQmzATg2xaFOH_GN2uFuXGtkxHBa-pchPYe-l-0KLM9XSj60DCnkyTHWANEVcKV8kS62ZZwLxC6hlssjLSSMgkVnBxxH9csBhKhRx4QcZxN_jXod3FuE2UyThq3YsELK51w9PV2B98aVElzT6AbjRF11FftHsf8_iYaeTsnbMMbfK8y8SZeS&src-supplier=Compliance+Statements; Pricing: 1=0.2, 10=0.121, 100=0.0749, 500=0.05458, 1000=0.04796 (USD); ComponentLink2Description: https://datasheet.octopart.com:443/MBT3946DW1T1G-onsemi-datasheet-180961818.pdf?src-supplier=IHS; ComponentLink6URL: https://datasheet.octopart.com:443/MBT3946DW1T1G-ON-Semiconductor-datasheet-14063995.pdf?src-supplier=iiiC; Collector Emitter Breakdown Voltage: 40V; ComponentLink8URL: https://datasheet.octopart.com:443/MBT3946DW1T1G-ON-Semiconductor-datasheet-53282.pdf?src-supplier=DigiKey; ComponentLink7Description: https://datasheet.octopart.com:443/MBT3946DW1T1G-ON-Semiconductor-datasheet-8443063.pdf?src-supplier=Jameco; Collector Emitter Voltage (VCEO): 40V; Introduction Date: 2001-12-09; Category: BJTs; ComponentLink10URL: http://sigma.octopart.com:80/reach_statement/ON-Semiconductor-company-79.pdf?src-supplier=Compliance+Statements; REACH SVHC: Yes; ComponentLink3URL: https://datasheet.octopart.com:443/MBT3946DW1T1G-ON-Semiconductor-datasheet-21210970.pdf?src-supplier=Newark; Radiation Hardening: No; Pin Count: 6; Source: MySchLib.SchLib; Max Breakdown Voltage: 40V; ComponentLink9Description: http://sigma.octopart.com:80/150614364/rohs_statement/ON-Semiconductor-MBT3946DW1T1G.pdf?src-supplier=Compliance+Statements; Max Power Dissipation: 150mW; ComponentLink7URL: https://datasheet.octopart.com:443/MBT3946DW1T1G-ON-Semiconductor-datasheet-8443063.pdf?src-supplier=Jameco; Design Item ID: MBT3946DW1T1G; Frequency: 300MHz; Case/Package: SC; Country of Origin: Mainland China; Contact Plating: Tin; Lifecycle Status: Production; Voltage Rating (DC): 40V; ComponentLink9URL: http://sigma.octopart.com:80/150614364/rohs_statement/ON-Semiconductor-MBT3946DW1T1G.pdf?src-supplier=Compliance+Statements; RoHS: Compliant; Gain Bandwidth Product: 300MHz; Current Rating: 200mA; Manufacturer Part Number: MBT3946DW1T1G; ComponentLink12URL: https://octopart.com:443/opatz8j6/c1?t=BISpIr3ce2Gk9m9EGmOSMwcK-x5suKSq_DrSb3eVUzWWJ4z4bkiXBslRgfr5v7yDwZzoUFysASo1ZzhqlQaJpngsy0772p-oxsjYAnshe9XcJmZ65XpfWSliA2xeOCy3IQ6K7q9WD0gmg1i8yBgSvh5cTfwtupqgCJl1fRBn7LV49bcAdFNpfQmzATg2xaFOH_GN2uFuXGtkxHBa-pchPYe-l-0KLM9XSj60DCnkyTHWANEVcKV8kS62ZZwLxC6hlssjLSSMgkVnBxxH9csBhKhRx4QcZxN_jXod3FuE2UyThq3YsELK51w9PV2B98aVElzT6AbjRF11FftHsf8_iYaeTsnbMMbfK8y8SZeS&src-supplier=Compliance+Statements; China RoHS: Compliant; ComponentLink6Description: https://datasheet.octopart.com:443/MBT3946DW1T1G-ON-Semiconductor-datasheet-14063995.pdf?src-supplier=iiiC; ComponentLink2URL: https://datasheet.octopart.com:443/MBT3946DW1T1G-onsemi-datasheet-180961818.pdf?src-supplier=IHS; Min Operating Temperature: -55°C; ComponentLink3Description: https://datasheet.octopart.com:443/MBT3946DW1T1G-ON-Semiconductor-datasheet-21210970.pdf?src-supplier=Newark; ComponentLink11Description: https://octopart.com:443/opatz8j6/c1?t=KExGiw7fVzcelvk-Le4wDxkM6D-rcpjtUrfE1ZnkBV1MEHfZW5pIblVuaNeX7tAqJdaaNxJ2hTDWsmCzxXF6UXlkyLkAFVEyfSFC-dz3mXUpSqcWplU2nWdRG5z1InXjEmusUj-8nsP9w_iTmWuEasAhDs2DNIUFXJnefYbYtIlTlG9nP5h3fZcncTha2JkO-YGgPnBD-R9hIY1a56svi-ABl7pPeB0blmwOOn-axnRyxdHzsQmPhFK4ZTpqwszMdgrm2nMkrexXFk7bhZX7TgLd2NPt5ZZ4373sCJaOlTerGriLJvqrLtinxa04dRTPq-WPk7pf8xNw7sWkA5V9tkrTEBovS5Xy8RO7fsaR_Q&src-supplier=Compliance+Statements; Length: 2.2mm; ComponentLink8Description: https://datasheet.octopart.com:443/MBT3946DW1T1G-ON-Semiconductor-datasheet-53282.pdf?src-supplier=DigiKey; ComponentLink4URL: https://datasheet.octopart.com:443/MBT3946DW1T1G-onsemi-datasheet-181959054.pdf?src-supplier=Newark; Max Operating Temperature: 150°C; ComponentLink5URL: https://datasheet.octopart.com:443/MBT3946DW1T1G-ON-Semiconductor-datasheet-8123988.pdf?src-supplier=onsemi; Number of Terminals: 6; Stock: 38516; ComponentLink1Description: https://datasheet.octopart.com:443/MBT3946DW1T1G-ON-Semiconductor-datasheet-8733982.pdf?src-supplier=Upverter; Schedule B: 8541210080, 8541210080; JLCPCB Part Number: C28272; Height: 1mm
Q2 = CMP-036-000087-3: Mosfet, Power; N-ch; Vdss 55V; Rds(on) 0.022 Ohm; Id 47A; D2PAK; Pd 110W; Vgs +/-16V; -55; Manufacturer: Infineon; Gate to Source Voltage (Vgs): 16V; Drain to Source Resistance: 25mO; Rise Time: 84ns; Rds On Max: 22mO; Value: 22mO; Input Capacitance: 1.7nF; Threshold Voltage: 2V; Turn-On Delay Time: 11ns; Number of Elements: 1; Element Configuration: Single; Max Power Dissipation: 3.8W; Fall Time: 15ns; Turn-Off Delay Time: 26ns; Max Junction Temperature (Tj): 175°C; Component Type: Standard; Lead Free: Lead Free; Pricing: 1=2.25, 10=1.437, 100=0.973 (USD); Package Quantity: 800; Pin Count: 3; RoHS: Compliant; ComponentLink9Description: http://sigma.octopart.com:80/reach_statement/International-Rectifier-company-55.pdf?src-supplier=Compliance+Statements; ComponentLink1URL: https://datasheet.octopart.com:443/IRLZ44NSTRLPBF-Infineon-datasheet-7566683.pdf?src-supplier=Newark; Schedule B: 8541290080, 8541290080; ComponentLink2Description: https://datasheet.octopart.com:443/IRLZ44NSTRLPBF-International-Rectifier-datasheet-9326.pdf?src-supplier=Newark; ComponentLink7URL: https://datasheet.octopart.com:443/IRLZ44NSTRLPBF-International-Rectifier-datasheet-49149.pdf?src-supplier=DigiKey; Drain to Source Breakdown Voltage: 55V; ComponentLink10URL: http://sigma.octopart.com:80/rohs_statement/International-Rectifier-company-54.pdf?src-supplier=Compliance+Statements; ComponentLink9URL: http://sigma.octopart.com:80/reach_statement/International-Rectifier-company-55.pdf?src-supplier=Compliance+Statements; REACH SVHC: No; ComponentLink2URL: https://datasheet.octopart.com:443/IRLZ44NSTRLPBF-International-Rectifier-datasheet-9326.pdf?src-supplier=Newark; ComponentLink7Description: https://datasheet.octopart.com:443/IRLZ44NSTRLPBF-International-Rectifier-datasheet-49149.pdf?src-supplier=DigiKey; ComponentLink4Description: https://datasheet.octopart.com:443/IRLZ44NSTRLPBF-Infineon-datasheet-8534184.pdf?src-supplier=Farnell; Category: MOSFETs; ComponentLink1Description: https://datasheet.octopart.com:443/IRLZ44NSTRLPBF-Infineon-datasheet-7566683.pdf?src-supplier=Newark; Introduction Date: 1996-11-01; Source: MySchLib.SchLib; Width: 9.65mm; Min Breakdown Voltage: 55V; Max Operating Temperature: 175°C; Radiation Hardening: No; ComponentLink5URL: https://datasheet.octopart.com:443/IRLZ44NSTRLPBF-Infineon-datasheet-9669855.pdf?src-supplier=RS+(Formerly+Allied+Electronics); ComponentLink5Description: https://datasheet.octopart.com:443/IRLZ44NSTRLPBF-Infineon-datasheet-9669855.pdf?src-supplier=RS+(Formerly+Allied+Electronics); ComponentLink6Description: https://datasheet.octopart.com:443/IRLZ44NSTRLPBF-International-Rectifier-datasheet-8827662.pdf?src-supplier=Jameco; Design Item ID: IRLZ44NSTRLPBF; ComponentLink6URL: https://datasheet.octopart.com:443/IRLZ44NSTRLPBF-International-Rectifier-datasheet-8827662.pdf?src-supplier=Jameco; Country of Origin: Mainland China; ComponentLink3URL: https://datasheet.octopart.com:443/IRLZ44NSTRLPBF-Infineon-datasheet-180073547.pdf?src-supplier=IHS; Pins: 3; Voltage Rating (DC): 55V; Case/Package: D2PAK; ComponentLink8Description: http://sigma.octopart.com:80/conflict_mineral_statement/Infineon-company-51.pdf?src-supplier=Compliance+Statements; Height: 5.084mm; Length: 10.668mm; Mounting Technology: Surface Mount; ComponentLink10Description: http://sigma.octopart.com:80/rohs_statement/International-Rectifier-company-54.pdf?src-supplier=Compliance+Statements; On-State Resistance: 22mO; Min Operating Temperature: -55°C; Number of Terminals: 2; Power Dissipation: 3.8W; China RoHS: Non-Compliant; Current Rating: 47A; Export Control Classification Number (ECCN) Code: EAR99; Lifecycle Status: NRND; Stock: 8520; Manufacturer Part Number: IRLZ44NSTRLPBF; ComponentLink8URL: http://sigma.octopart.com:80/conflict_mineral_statement/Infineon-company-51.pdf?src-supplier=Compliance+Statements; Drain to Source Voltage (Vdss): 55V; Number of Channels: 1; ComponentLink4URL: https://datasheet.octopart.com:443/IRLZ44NSTRLPBF-Infineon-datasheet-8534184.pdf?src-supplier=Farnell; ComponentLink3Description: https://datasheet.octopart.com:443/IRLZ44NSTRLPBF-Infineon-datasheet-180073547.pdf?src-supplier=IHS; Continuous Drain Current (ID): 47A; JLCPCB Part Number: C18212570
R1 = CMP-009-00179-2: 10k Ohm 0603 5% Chip Resistor SMD; Manufacturer Part Number: 0603WAJ0103T5E; Manufacturer: Royal Ohm; Value: 10kO; Working Voltage: 75V; Power Rating: 100mW; Temperature Coefficient: 100ppm/°C; Width: 800µm; ComponentLink3Description: https://datasheet.octopart.com:443/0603WAJ0103T5E-Royal-Ohm-datasheet-157855877.pdf?src-supplier=TME; Min Operating Temperature: -55°C; ComponentLink1Description: https://datasheet.octopart.com:443/0603WAJ0103T5E-Royal-Electronics-datasheet-181080982.pdf?src-supplier=IHS; China RoHS: Non-Compliant; Source: MySchLib.SchLib; RoHS: Compliant; ComponentLink4Description: https://datasheet.octopart.com:443/0603WAJ0103T5E-Royal-Ohm-datasheet-62069544.pdf?src-supplier=TME; ComponentLink3URL: https://datasheet.octopart.com:443/0603WAJ0103T5E-Royal-Ohm-datasheet-157855877.pdf?src-supplier=TME; Number of Terminals: 2; Height: 450µm; Tolerance: 5%; Pin Count: 2; Design Item ID: 0603WAJ0103T5E; Component Type: Standard; Pricing: 10000=0.001 (USD); Category: Chip SMD Resistors; Mounting Technology: Surface Mount; ComponentLink2URL: https://datasheet.octopart.com:443/0603WAJ0103T5E-Royal-Ohm-datasheet-165785611.pdf?src-supplier=TME; JLCPCB Part Number: C25804; ComponentLink2Description: https://datasheet.octopart.com:443/0603WAJ0103T5E-Royal-Ohm-datasheet-165785611.pdf?src-supplier=TME; Case/Package: 0603; ComponentLink1URL: https://datasheet.octopart.com:443/0603WAJ0103T5E-Royal-Electronics-datasheet-181080982.pdf?src-supplier=IHS; Stock: 170000; Max Operating Temperature: 155°C; ComponentLink4URL: https://datasheet.octopart.com:443/0603WAJ0103T5E-Royal-Ohm-datasheet-62069544.pdf?src-supplier=TME; REACH SVHC: Yes; Lifecycle Status: Production; Length: 1.6mm
R2 R15 = CMP-009-00181-2: 220 Ohm 0603 5% Chip Resistor SMD; Manufacturer: Royal Ohm; Manufacturer Part Number: 0603WAJ0221T5E; Value: 220O; ComponentLink3URL: https://datasheet.octopart.com:443/0603WAJ0221T5E-Royal-Ohm-datasheet-62069544.pdf?src-supplier=TME; Pricing: 10000=0.001 (USD); Stock: 10000; ComponentLink2URL: https://datasheet.octopart.com:443/0603WAJ0221T5E-Royal-Ohm-datasheet-157855877.pdf?src-supplier=TME; ComponentLink1URL: https://datasheet.octopart.com:443/0603WAJ0221T5E-Royal-Ohm-datasheet-165785611.pdf?src-supplier=TME; ComponentLink3Description: https://datasheet.octopart.com:443/0603WAJ0221T5E-Royal-Ohm-datasheet-62069544.pdf?src-supplier=TME; ComponentLink2Description: https://datasheet.octopart.com:443/0603WAJ0221T5E-Royal-Ohm-datasheet-157855877.pdf?src-supplier=TME; ComponentLink1Description: https://datasheet.octopart.com:443/0603WAJ0221T5E-Royal-Ohm-datasheet-165785611.pdf?src-supplier=TME; Pin Count: 2; Source: MySchLib.SchLib; Component Type: Standard; Design Item ID: 0603WAJ0221T5E; Category: Uncategorized; JLCPCB Part Number: C22962
R3 = CMP-009-00180-2: 22 Ohm 0603 1% Chip Resistor SMD; Manufacturer Part Number: 0603WAJ0220T5E; Manufacturer: Royal Ohm; Working Voltage: 75V; Value: 22; Power Rating: 100mW; Temperature Coefficient: 100ppm/°C; Length: 1.6mm; ComponentLink1Description: https://datasheet.octopart.com:443/0603WAJ0220T5E-Royal-Electronics-datasheet-181080982.pdf?src-supplier=IHS; Number of Terminals: 2; ComponentLink4Description: https://datasheet.octopart.com:443/0603WAJ0220T5E-Royal-Ohm-datasheet-62069544.pdf?src-supplier=TME; Max Operating Temperature: 155°C; RoHS: Compliant; ComponentLink1URL: https://datasheet.octopart.com:443/0603WAJ0220T5E-Royal-Electronics-datasheet-181080982.pdf?src-supplier=IHS; JLCPCB Part Number: C1203; Case/Package: 0603; ComponentLink4URL: https://datasheet.octopart.com:443/0603WAJ0220T5E-Royal-Ohm-datasheet-62069544.pdf?src-supplier=TME; Lifecycle Status: Production; Stock: 50000; ComponentLink3Description: https://datasheet.octopart.com:443/0603WAJ0220T5E-Royal-Ohm-datasheet-157855877.pdf?src-supplier=TME; REACH SVHC: Yes; Pin Count: 2; Tolerance: 5%; ComponentLink2URL: https://datasheet.octopart.com:443/0603WAJ0220T5E-Royal-Ohm-datasheet-165785611.pdf?src-supplier=TME; Min Operating Temperature: -55°C; Width: 800µm; Component Type: Standard; Pricing: 10000=0.001 (USD); ComponentLink2Description: https://datasheet.octopart.com:443/0603WAJ0220T5E-Royal-Ohm-datasheet-165785611.pdf?src-supplier=TME; Category: Chip SMD Resistors; ComponentLink3URL: https://datasheet.octopart.com:443/0603WAJ0220T5E-Royal-Ohm-datasheet-157855877.pdf?src-supplier=TME; Design Item ID: 0603WAJ0220T5E; Mounting Technology: Surface Mount; Height: 450µm; Source: MySchLib.SchLib